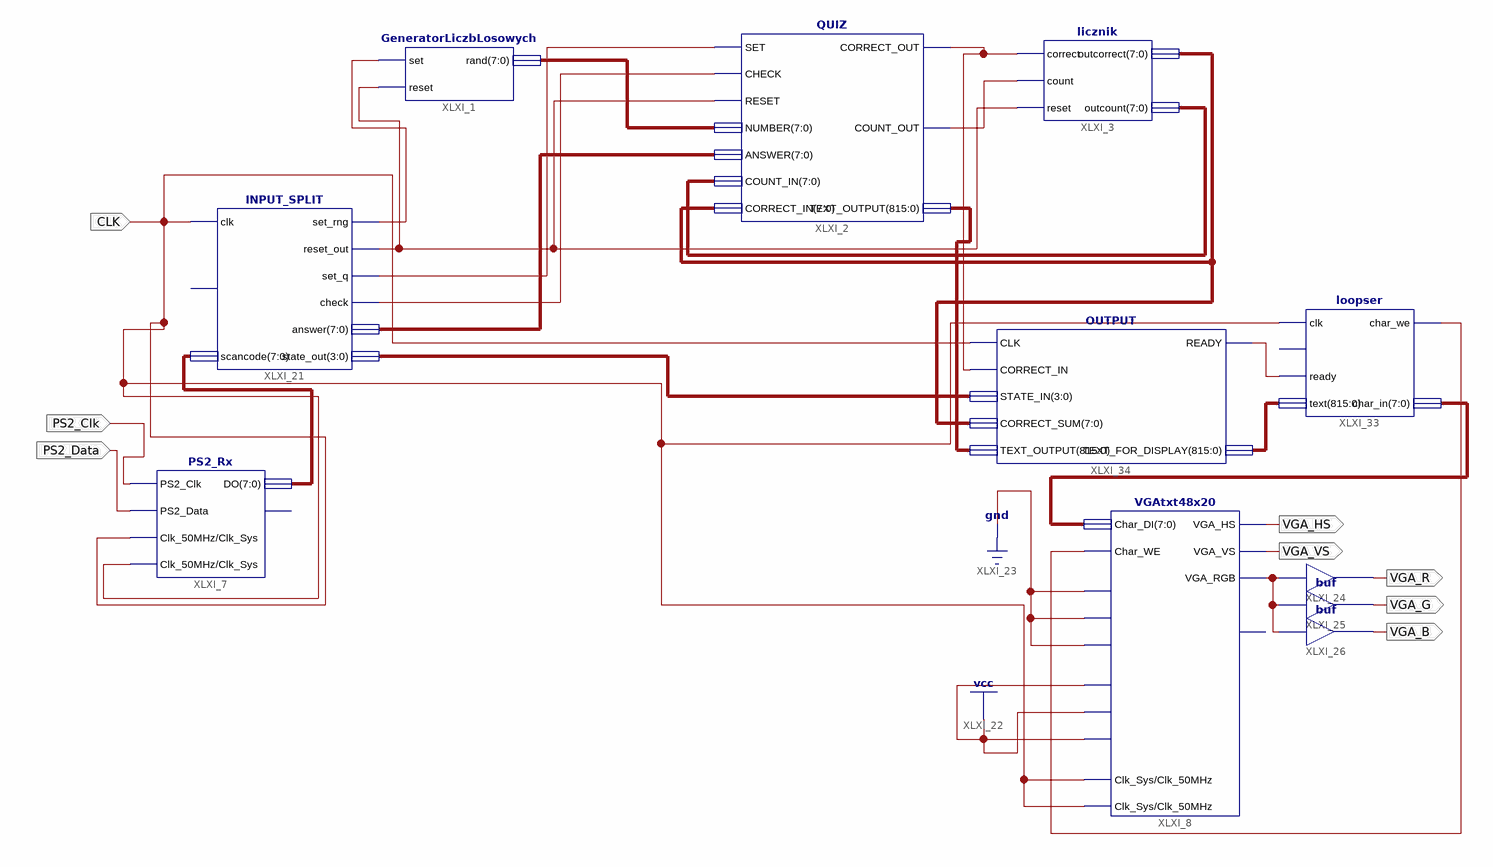
[diagram p0: schematic sheet 1]
// Xilinx ISE schematic core.sch (spartan3e) as structural Verilog: 11 symbols, 8 ports
module core (
  input  CLK,
  input  PS2_Clk,
  input  PS2_Data,
  output VGA_HS,
  output VGA_VS,
  output VGA_R,
  output VGA_G,
  output VGA_B
);

  wire VGA_RGB, XLXN_3, XLXN_8, XLXN_9, XLXN_11, XLXN_12, XLXN_14, XLXN_32, XLXN_34;
  wire [3:0] XLXN_15;
  wire [7:0] XLXN_1, XLXN_6, XLXN_13, XLXN_17, XLXN_20, XLXN_33;
  wire [815:0] XLXN_18, XLXN_31;

  GeneratorLiczbLosowych XLXI_1 (.set(XLXN_8), .reset(XLXN_9), .\rand (XLXN_1));
  QUIZ XLXI_2 (
    .SET(XLXN_11), .CHECK(XLXN_12), .RESET(XLXN_9), .NUMBER(XLXN_1), .ANSWER(XLXN_13), .COUNT_IN(XLXN_6),
    .CORRECT_IN(XLXN_17), .CORRECT_OUT(XLXN_14), .COUNT_OUT(XLXN_3), .TEXT_OUTPUT(XLXN_18));
  licznik XLXI_3 (.correct(XLXN_14), .count(XLXN_3), .reset(XLXN_9), .outcorrect(XLXN_17), .outcount(XLXN_6));
  PS2_Rx XLXI_7 (.PS2_Clk(PS2_Clk), .PS2_Data(PS2_Data), .Clk_50MHz(CLK), .Clk_Sys(CLK), .DO(XLXN_20));  // open: DO_Rdy
  VGAtxt48x20 XLXI_8 (
    .Char_DI(XLXN_33), .Home(1'b0), .NewLine(1'b0), .Goto00(1'b0), .Clk_Sys(CLK), .Clk_50MHz(CLK),
    .CursorOn(1'b1), .ScrollEn(1'b1), .ScrollClear(1'b1), .VGA_HS(VGA_HS), .VGA_VS(VGA_VS),
    .VGA_RGB(VGA_RGB), .Char_WE(XLXN_34));  // open: Busy
  INPUT_SPLIT XLXI_21 (
    .clk(CLK), .scancode(XLXN_20), .set_rng(XLXN_8), .reset_out(XLXN_9), .set_q(XLXN_11), .check(XLXN_12),
    .answer(XLXN_13), .state_out(XLXN_15));  // open: reset
  buf XLXI_24 (VGA_R, VGA_RGB);
  buf XLXI_25 (VGA_G, VGA_RGB);
  buf XLXI_26 (VGA_B, VGA_RGB);
  loopser XLXI_33 (.clk(CLK), .ready(XLXN_32), .text(XLXN_31), .char_we(XLXN_34), .char_in(XLXN_33));  // open: asdf
  OUTPUT XLXI_34 (
    .CLK(CLK), .CORRECT_IN(XLXN_14), .STATE_IN(XLXN_15), .CORRECT_SUM(XLXN_17), .TEXT_OUTPUT(XLXN_18),
    .READY(XLXN_32), .TEXT_FOR_DISPLAY(XLXN_31));
endmodule
